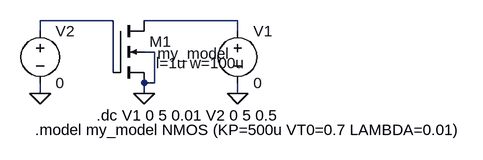
[diagram p0: schematic MOSFET - I.asc]
MOSFET - I.asc, the LTspice schematic file:
Version 4
SHEET 1 880 680
WIRE 128 96 16 96
WIRE 320 96 176 96
WIRE 16 112 16 96
WIRE 320 112 320 96
WIRE 192 144 176 144
WIRE 128 176 128 96
WIRE 192 192 192 144
WIRE 192 192 176 192
WIRE 16 208 16 192
WIRE 176 208 176 192
WIRE 320 208 320 192
FLAG 16 208 0
FLAG 176 208 0
FLAG 320 208 0
SYMBOL nmos4 128 96 R0
WINDOW 3 69 51 Left 2
WINDOW 123 66 65 Left 2
SYMATTR InstName M1
SYMATTR Value my_model
SYMATTR Value2 l=1u w=100u
SYMBOL voltage 320 96 R0
WINDOW 123 0 0 Left 2
WINDOW 39 0 0 Left 2
SYMATTR InstName V1
SYMATTR Value 0
SYMBOL voltage 16 96 R0
WINDOW 123 0 0 Left 2
WINDOW 39 0 0 Left 2
SYMATTR InstName V2
SYMATTR Value 0
TEXT 8 264 Left 2 !.model my_model NMOS (KP=500u VT0=0.7 LAMBDA=0.01)
TEXT 103 242 Left 2 !.dc V1 0 5 0.01 V2 0 5 0.5

The netlist it stands for:
* MOSFET - I.asc
M1 N002 N001 0 0 my_model l=1u w=100u
V1 N002 0 0
V2 N001 0 0
.model NMOS NMOS
.model PMOS PMOS
.lib standard.mos
.model my_model NMOS (KP=500u VT0=0.7 LAMBDA=0.01)
.dc V1 0 5 0.01 V2 0 5 0.5
.backanno
.end